# EAGLE design IRDistroBoard (EAGLE 7.4.0)
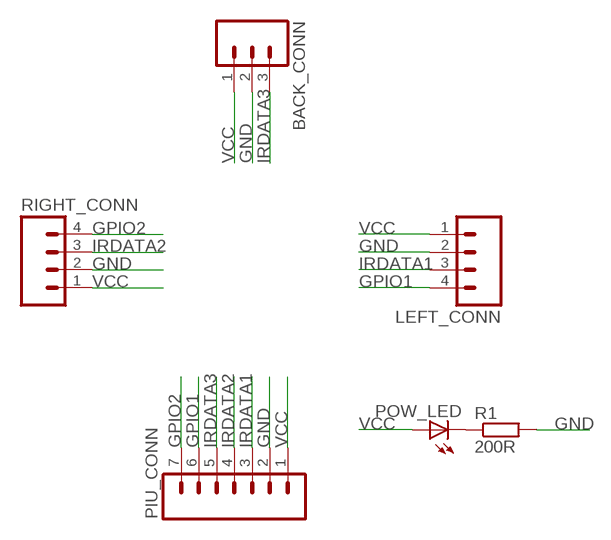
[diagram p0: schematic, sheet 1]

## Parts
BACK_CONN  M03PTH  [1X03]
LEFT_CONN  M04PTH  [1X04]
PIU_CONN  M07  [1X07]
POW_LED  LEDCHIPLED_0805  [CHIPLED_0805]
R1  200R  RESISTORR805-0805  [R805]
RIGHT_CONN  M04PTH  [1X04]

## Nets
GND: BACK_CONN.2 LEFT_CONN.2 PIU_CONN.2 R1.2 RIGHT_CONN.2
GPIO1: LEFT_CONN.4 PIU_CONN.6
GPIO2: PIU_CONN.7 RIGHT_CONN.4
IRDATA1: LEFT_CONN.3 PIU_CONN.3
IRDATA2: PIU_CONN.4 RIGHT_CONN.3
IRDATA3: BACK_CONN.3 PIU_CONN.5
N$1: POW_LED.C R1.1
VCC: BACK_CONN.1 LEFT_CONN.1 PIU_CONN.1 POW_LED.A RIGHT_CONN.1

## Library data of the parts
BACK_CONN = BryanConnectors:M03: Header 3 Standard 3-pin 0.1" header. Use with straight break away headers (SKU : PRT-00116), right angle break away headers (PRT-00553), swiss pins (PRT-00743), machine pins (PRT-00117), and female headers (PRT-00115). Molex polarized connector foot print use with SKU : PRT-08232 with associated crimp pins and housings.
LEFT_CONN RIGHT_CONN = BryanConnectors:M04: Header 4 Standard 4-pin 0.1" header. Use with straight break away headers (SKU : PRT-00116), right angle break away headers (PRT-00553), swiss pins (PRT-00743), machine pins (PRT-00117), and female headers (PRT-00115). Molex polarized connector foot print use with SKU : PRT-08231 with associated crimp pins and housings. 1MM SMD Version SKU: PRT-10208
PIU_CONN = BryanConnectors:M07: Header 7 Standard 7-pin 0.1" header. Use with straight break away headers (SKU : PRT-00116), right angle break away headers (PRT-00553), swiss pins (PRT-00743), machine pins (PRT-00117), and female headers (PRT-00115). NOTES ON THE VARIANTS LOCK and LOCK_LONGPADS... This footprint was designed to help hold the alignment of a through-hole component (i.e. 7-pin header) while soldering it into place. You may notice that each hole has been shifted either up or down by 0.005 of an inch from it's more standard position (which is usually a perfectly straight line). This slight alteration caused the pins (the squares in the middle) to touch the edges of the holes. Because they are alternating, it causes a "brace" to hold the header in place. 0.005 has proven to be the perfect amount of "off-center" position when using our standard breakaway headers. Although looks a little odd when you look at the bare footprint, once you have a header in there, the alteration is very hard to notice. Also, if you push a header all the way into place, it is covered up entirely on the bottom side. This idea of altering the position of holes to aid alignment will be further integrated into the Sparkfun Library for other footprints. It can help hold any component with 3 or more connection pins.
POW_LED = led:LED: LED OSRAM: - CHIPLED LG R971, LG N971, LY N971, LG Q971, LY Q971, LO R971, LY R971 LH N974, LH R974 LS Q976, LO Q976, LY Q976 LO Q996 - Hyper CHIPLED LW Q18S LB Q993, LB Q99A, LB R99A - SideLED LS A670, LO A670, LY A670, LG A670, LP A670 LB A673, LV A673, LT A673, LW A673 LH A674 LY A675 LS A676, LA A676, LO A676, LY A676, LW A676 LS A679, LY A679, LG A679 - Hyper Micro SIDELED® LS Y876, LA Y876, LO Y876, LY Y876 LT Y87S - SmartLED LW L88C, LW L88S LB L89C, LB L89S, LG L890 LS L89K, LO L89K, LY L89K LS L896, LA L896, LO L896, LY L896 - TOPLED LS T670, LO T670, LY T670, LG T670, LP T670 LSG T670, LSP T670, LSY T670, LOP T670, LYG T670 LG T671, LOG T671, LSG T671 LB T673, LV T673, LT T673, LW T673 LH T674 LS T676, LA T676, LO T676, LY T676, LB T676, LH T676, LSB T676, LW T676 LB T67C, LV T67C, LT T67C, LS T67K, LO T67K, LY T67K, LW E67C LS E67B, LA E67B, LO E67B, LY E67B, LB E67C, LV E67C, LT E67C LW T67C LS T679, LY T679, LG T679 LS T770, LO T770, LY T770, LG T770, LP T770 LB T773, LV T773, LT T773, LW T773 LH T774 LS E675, LA E675, LY E675, LS T675 LS T776, LA T776, LO T776, LY T776, LB T776 LHGB T686 LT T68C, LB T68C - Hyper Mini TOPLED® LB M676 - Mini TOPLED Santana® LG M470 LS M47K, LO M47K, LY M47K Source: http://www.osram.convergy.de LUXEON: - LUMILED® LXK2-PW12-R00, LXK2-PW12-S00, LXK2-PW14-U00, LXK2-PW14-V00 LXK2-PM12-R00, LXK2-PM12-S00, LXK2-PM14-U00 LXK2-PE12-Q00, LXK2-PE12-R00, LXK2-PE12-S00, LXK2-PE14-T00, LXK2-PE14-U00 LXK2-PB12-K00, LXK2-PB12-L00, LXK2-PB12-M00, LXK2-PB14-N00, LXK2-PB14-P00, LXK2-PB14-Q00 LXK2-PR12-L00, LXK2-PR12-M00, LXK2-PR14-Q00, LXK2-PR14-R00 LXK2-PD12-Q00, LXK2-PD12-R00, LXK2-PD12-S00 LXK2-PH12-R00, LXK2-PH12-S00 LXK2-PL12-P00, LXK2-PL12-Q00, LXK2-PL12-R00 Source: www.luxeon.com KINGBRIGHT: KA-3528ASYC Source: www.kingbright.com
R1 = dp_devices:RESISTOR

## Board
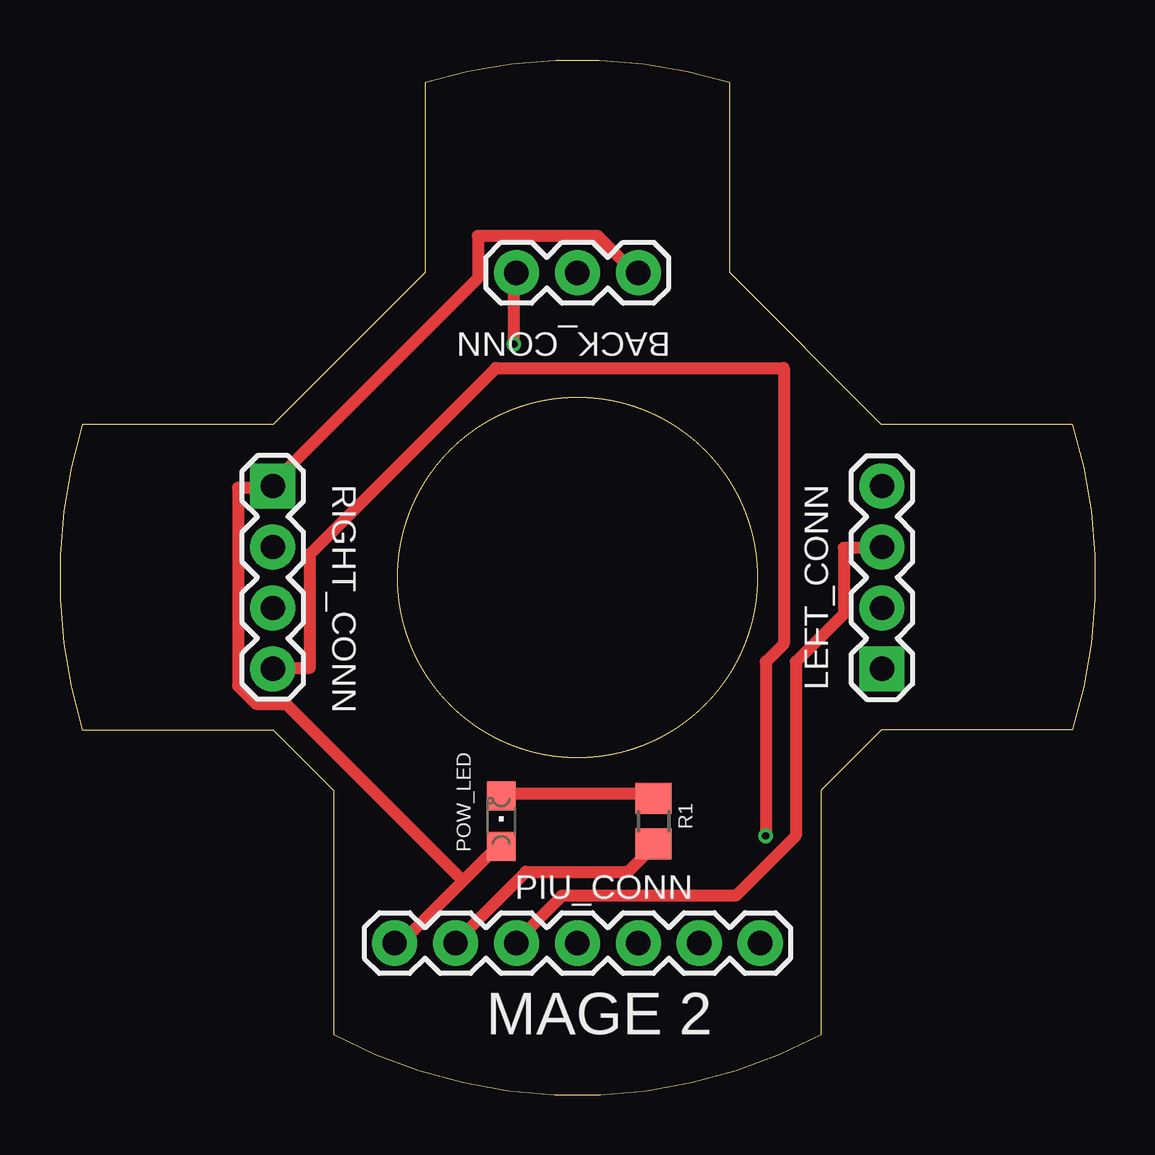
[diagram p1: board, top side]
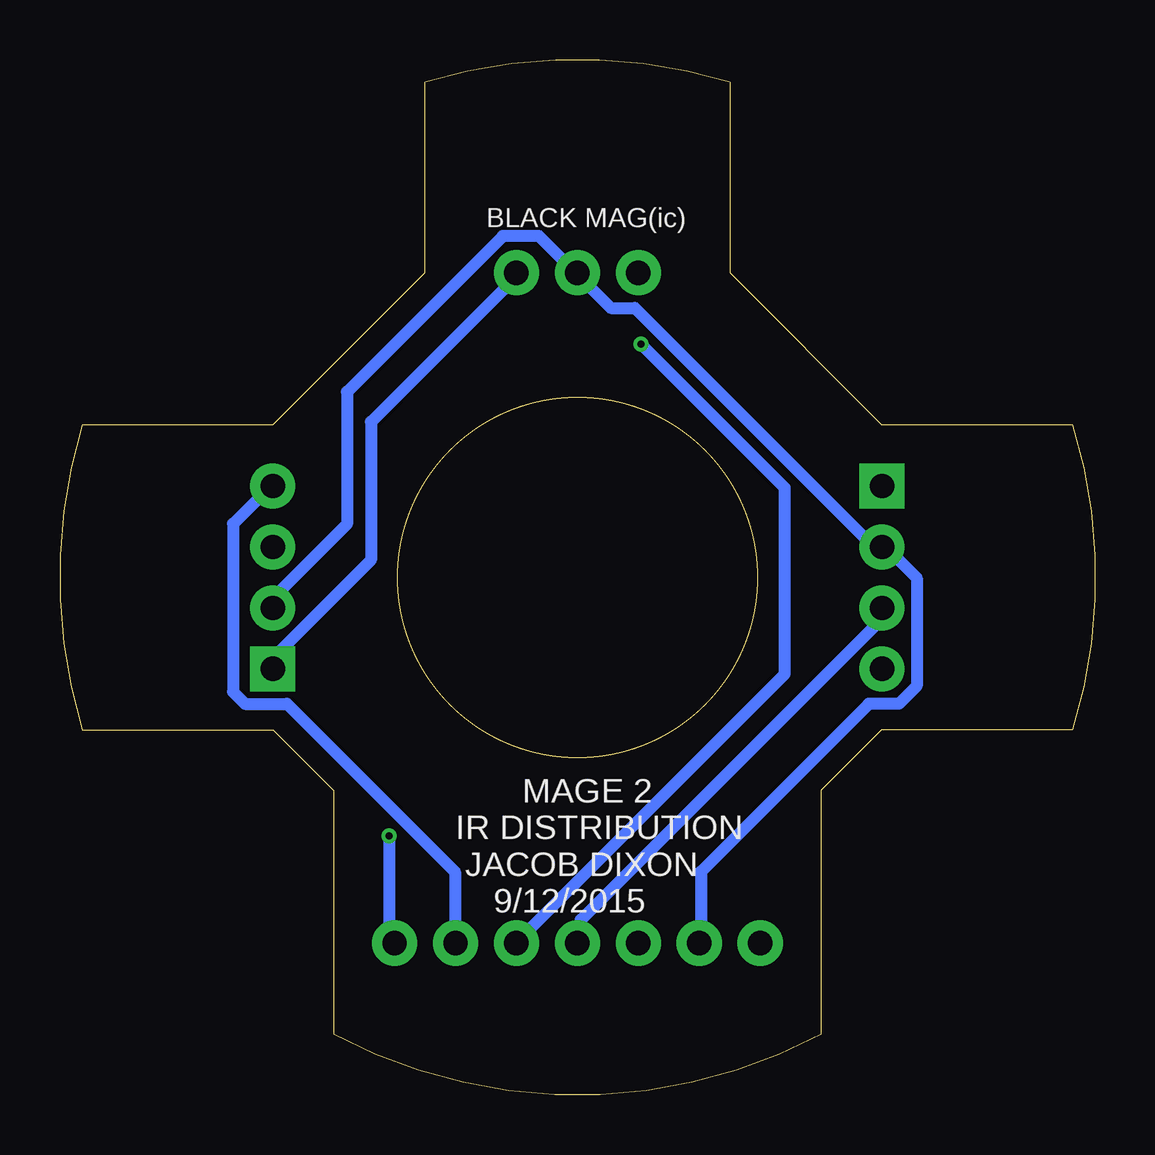
[diagram p2: board, bottom side, seen from below]

Size 43.14 x 43.13 mm. Coordinates in mm from the lower left corner, seen from the top.
Outline: 42.2,27.93 34.25,27.93 27.92,34.26 27.92,42.19
Outline: 15.22,42.19 15.22,34.26 8.89,27.93 0.94,27.93
Outline: 11.41,2.51 11.41,12.69 8.89,15.21 0.93,15.21
Outline: 42.2,15.21 34.25,15.21 31.73,12.69 31.73,2.51
Outline: 15.22,42.2 arc-34 27.92,42.2
Outline: 11.41,2.51 arc56 31.73,2.51
Outline: 0.93,27.93 arc34 0.93,15.21
Outline: 42.21,27.93 arc-34 42.21,15.21
Outline: circle at 21.57,21.56 radius 7.5
Copper layers (1*16): Top 0.035mm / dielectric 1.5mm / Bottom 0.035mm
Design rules "dirt_cheap_dirty_boards.v1 *": minimum track width 20mil, minimum drill 12mil, track to track 10mil, track to pad 10mil, pad to pad 10mil, via to via 10mil, smd to smd 0mil, copper to edge 30mil, drill to drill 10mil, minimum pad ring 10mil, minimum via ring 6mil, stop-mask expansion 2mil, vias tented up to drill 25mil, thermal gap 10mil

### Footprints (pad centres in the part's own frame; a part is rotated, then mirrored left to right if it is on the bottom)
1X03 = drill 1.016 pad 1.88: 1 0,0; 2 2.54,0; 3 5.08,0
1X04 = drill 1.016 pad 1.88 square: 1 0,0 | drill 1.016 pad 1.88: 2 2.54,0; 3 5.08,0; 4 7.62,0
1X07 = drill 1.016 pad 1.88: 1 0,0; 2 2.54,0; 3 5.08,0; 4 7.62,0; 5 10.16,0; 6 12.7,0; 7 15.24,0
CHIPLED_0805 = smd 1.2 x 1.2: A 0,-1.05; C 0,1.05
R805 = smd 1.3 x 1.5: 1 -0.95,0; 2 0.95,0

### Placement (x,y rotation side)
BACK_CONN  24.11,34.26 180 top
LEFT_CONN  34.27,17.75 90 top
PIU_CONN  13.95,6.32 0 top
POW_LED  18.39,11.4 0 top
R1  24.74,11.4 270 top
RIGHT_CONN  8.87,25.37 270 top

### Tracks (layer width: path | path; a pad name or v marks a point on that pad's centre or on a via)
GND
  Top 0.508: R1.2 24.67,10.29 23.67,9.29 19.42,9.29 16.67,6.54 PIU_CONN.2
  Bottom 0.508: LEFT_CONN.2 34.17,20.29 34.17,20.79 31.17,23.79 31.17,29.29 24.67,35.79 23.17,35.79 21.67,34.29 BACK_CONN.2 21.42,34.04 20.17,32.79 19.17,32.79 9.42,23.04 8.92,23.04 RIGHT_CONN.2 8.67,22.79 7.42,21.54 7.42,17.04 8.17,16.29 9.42,16.29 16.42,9.29 16.42,6.54 PIU_CONN.2
GPIO1
  Bottom 0.508: PIU_CONN.6 26.67,6.54 26.67,9.29 33.67,16.29 35.42,16.29 35.92,16.79 35.92,23.79 34.42,25.29 LEFT_CONN.4
GPIO2  (via drill 0.3)
  Top 0.508: v29.42,10.79 29.42,18.04 30.17,18.79 30.17,30.29 18.17,30.29 10.42,22.54 10.42,17.79 8.92,17.79 RIGHT_CONN.4
  Bottom 0.508: v29.42,10.79 29.42,6.54 PIU_CONN.7
IRDATA1
  Top 0.508: PIU_CONN.3 19.17,6.54 20.92,8.29 28.17,8.29 30.67,10.79 30.67,18.04 32.67,20.04 32.67,22.79 34.17,22.79 LEFT_CONN.3
IRDATA2
  Bottom 0.508: RIGHT_CONN.3 8.92,20.29 8.92,19.79 21.42,7.29 21.42,6.54 PIU_CONN.4
IRDATA3  (via drill 0.3)
  Top 0.508: v18.92,31.29 18.92,34.04 BACK_CONN.3
  Bottom 0.508: v18.92,31.29 12.92,25.29 12.92,17.54 23.92,6.54 PIU_CONN.5
N$1
  Top 0.508: POW_LED.C 18.42,12.54 24.67,12.54 R1.1
VCC
  Top 0.508: 16.79,8.91 14.42,6.54 14.17,6.54 PIU_CONN.1 | 16.79,8.91 18.17,10.29 POW_LED.A | BACK_CONN.1 23.92,34.29 22.42,35.79 17.42,35.79 17.42,34.04 8.92,25.54 RIGHT_CONN.1 8.67,25.29 7.42,25.29 7.42,17.04 8.17,16.29 9.42,16.29 16.79,8.91
  Bottom 0.508: LEFT_CONN.1 34.17,17.79 34.17,18.29 30.17,22.29 30.17,28.04 24.17,34.04 BACK_CONN.1

### Text on the board
_tsilk: MAGE 2
_bsilk: BLACK MAG(ic) | MAGE 2 / IR DISTRIBUTION / JACOB DIXON / 9/12/2015